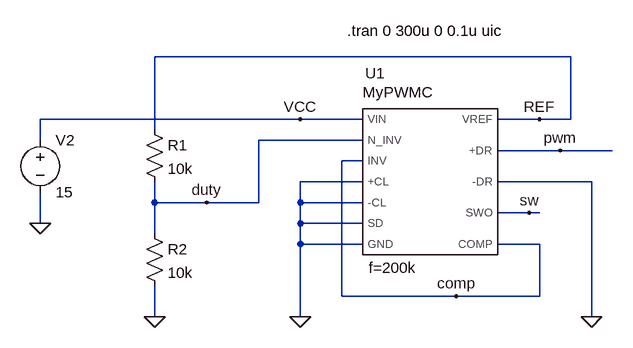
[diagram p0: schematic MyPWMC - test.asc]
MyPWMC - test.asc, the LTspice schematic file:
Version 4
SHEET 1 2084 1268
WIRE 992 -32 352 -32
WIRE 576 64 176 64
WIRE 672 64 576 64
WIRE 944 64 880 64
WIRE 992 64 992 -32
WIRE 992 64 944 64
WIRE 352 80 352 -32
WIRE 176 96 176 64
WIRE 672 96 512 96
WIRE 976 112 880 112
WIRE 1056 112 976 112
WIRE 672 128 640 128
WIRE 672 160 576 160
WIRE 1024 160 880 160
WIRE 352 192 352 160
WIRE 432 192 352 192
WIRE 512 192 512 96
WIRE 512 192 432 192
WIRE 576 192 576 160
WIRE 672 192 576 192
WIRE 928 208 880 208
WIRE 944 208 928 208
WIRE 176 224 176 176
WIRE 576 224 576 192
WIRE 672 224 576 224
WIRE 352 240 352 192
WIRE 576 256 576 224
WIRE 672 256 576 256
WIRE 944 256 880 256
WIRE 640 336 640 128
WIRE 816 336 640 336
WIRE 944 336 944 256
WIRE 944 336 816 336
WIRE 352 368 352 320
WIRE 576 368 576 256
WIRE 1024 368 1024 160
FLAG 176 224 0
FLAG 352 368 0
FLAG 576 64 VCC
FLAG 576 368 0
FLAG 944 64 REF
FLAG 432 192 duty
FLAG 816 336 comp
FLAG 976 112 pwm
FLAG 928 208 sw
FLAG 1024 368 0
SYMBOL voltage 176 80 R0
WINDOW 123 0 0 Left 0
WINDOW 39 0 0 Left 0
SYMATTR InstName V2
SYMATTR Value 15
SYMBOL res 336 64 R0
SYMATTR InstName R1
SYMATTR Value 10k
SYMBOL res 336 224 R0
SYMATTR InstName R2
SYMATTR Value 10k
SYMBOL MyPWMC 752 160 R0
WINDOW 0 -61 -151 Bottom 2
WINDOW 38 -26 -122 Bottom 2
WINDOW 3 -34 148 Bottom 2
SYMATTR InstName U1
SYMATTR Value f=200k
TEXT 648 -72 Left 2 !.tran 0 300u 0 0.1u uic

The netlist it stands for:
* MyPWMC - test.asc
V2 VCC 0 15
R1 REF duty 10k
R2 duty 0 10k
XU1 VCC duty comp 0 0 0 0 comp sw 0 pwm REF MyPWMC f=200k  ; pins VIN N_INV INV +CL -CL SD GND COMP SWO -DR +DR VREF
.tran 0 300u 0 0.1u uic
.lib MyPWMC.sub
.backanno
.end